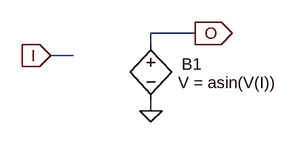
[diagram p0: schematic asin_module.asc]
asin_module.asc, the LTspice schematic file:
Version 4
SHEET 1 880 680
WIRE 240 160 176 160
WIRE 176 176 176 160
WIRE 64 192 32 192
WIRE 176 272 176 256
FLAG 32 192 I
IOPIN 32 192 In
FLAG 176 272 0
FLAG 240 160 O
IOPIN 240 160 Out
SYMBOL bv 176 160 R0
WINDOW 0 44 44 Left 0
WINDOW 3 39 71 Left 0
SYMATTR InstName B1
SYMATTR Value V = asin(V(I))

The netlist it stands for:
* asin_module.asc
B1 O 0 V = asin(V(I))
.backanno
.end